# EAGLE design watchwinder (EAGLE 8.2.2)
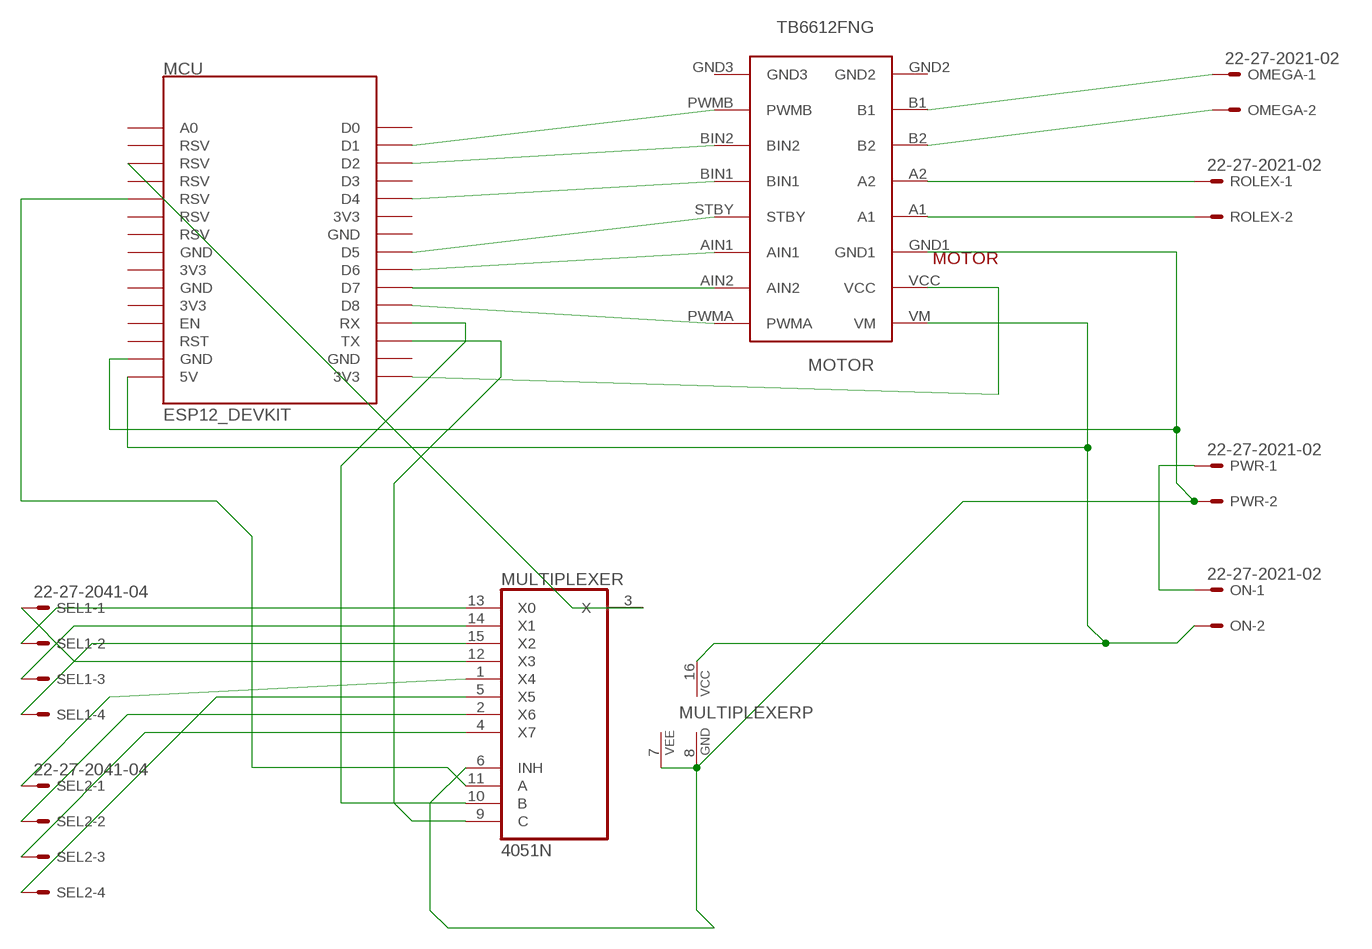
[diagram p0: schematic, sheet 1]

## Parts
MCU  ESP12_DEVKIT  [ESP12_DEVKIT]
MOTOR  TB6612FNG  [TB6612FNG]
MULTIPLEXER  4051N  [DIL16]
OMEGA  22-27-2021-02  [6410-02]
ON  22-27-2021-02  [6410-02]
PWR  22-27-2021-02  [6410-02]
ROLEX  22-27-2021-02  [6410-02]
SEL1  22-27-2041-04  [6410-04]
SEL2  22-27-2041-04  [6410-04]

## Nets
GND: MCU.GND@1(GND) MOTOR.GND1 MULTIPLEXER.6(INH) MULTIPLEXER.7(VEE) MULTIPLEXER.8(GND) PWR.2
N$1: MCU.D1 MOTOR.PWMB
N$2: MCU.D2 MOTOR.BIN2
N$3: MCU.D4 MOTOR.BIN1
N$4: MCU.D5 MOTOR.STBY
N$5: MCU.D6 MOTOR.AIN1
N$6: MCU.D7 MOTOR.AIN2
N$7: MCU.D8 MOTOR.PWMA
N$8: MOTOR.A2 ROLEX.1
N$9: MOTOR.A1 ROLEX.2
N$10: MOTOR.B1 OMEGA.1
N$11: MOTOR.B2 OMEGA.2
N$12: MCU.3V3@2(3V3) MOTOR.VCC
N$13: ON.1 PWR.1
N$14: MCU.5V MOTOR.VM MULTIPLEXER.16(VCC) ON.2
N$16: MULTIPLEXER.12(X3) SEL1.1
N$17: MULTIPLEXER.14(X1) SEL1.3
N$18: MULTIPLEXER.15(X2) SEL1.4
N$19: MULTIPLEXER.13(X0) SEL1.2
N$20: MULTIPLEXER.1(X4) SEL2.1
N$21: MULTIPLEXER.2(X6) SEL2.2
N$22: MULTIPLEXER.4(X7) SEL2.3
N$23: MULTIPLEXER.5(X5) SEL2.4
N$24: MCU.RX MULTIPLEXER.10(B)
N$25: MCU.RSV@3(RSV) MULTIPLEXER.11(A)
N$26: MCU.TX MULTIPLEXER.9(C)
N$27: MCU.RSV@1(RSV) MULTIPLEXER.3(X)
Unconnected: MCU.3V3@0(3V3) MCU.3V3@1(3V3) MCU.3V3@3(3V3) MCU.A0 MCU.D0 MCU.D3 MCU.EN MCU.GND@0(GND) MCU.GND@2(GND) MCU.GND@3(GND) MCU.GND@4(GND) MCU.RST MCU.RSV@0(RSV) MCU.RSV@2(RSV) MCU.RSV@4(RSV) MCU.RSV@5(RSV) MOTOR.GND2 MOTOR.GND3

## Library data of the parts
MCU = ESP12_DEVKIT:ESP12_DEVKIT: ESP12 DEVKIT BOARD
MOTOR = TB6612FNG:TB6612FNG
MULTIPLEXER = 40xx:4051: 8-channel ANALOG MULTIPLEXER
OMEGA ON PWR ROLEX = con-molex:22-?-02: CONNECTOR wire to board 2.54 mm (.1 inch) pitch header; OC_FARNELL: unknown; OC_NEWARK: unknown
SEL1 SEL2 = con-molex:22-?-04: CONNECTOR wire to board 2.54 mm (.1 inch) pitch header; OC_FARNELL: unknown; OC_NEWARK: unknown

## Net classes
0 default: width 0.508 mm, clearance 0.127 mm

## Board
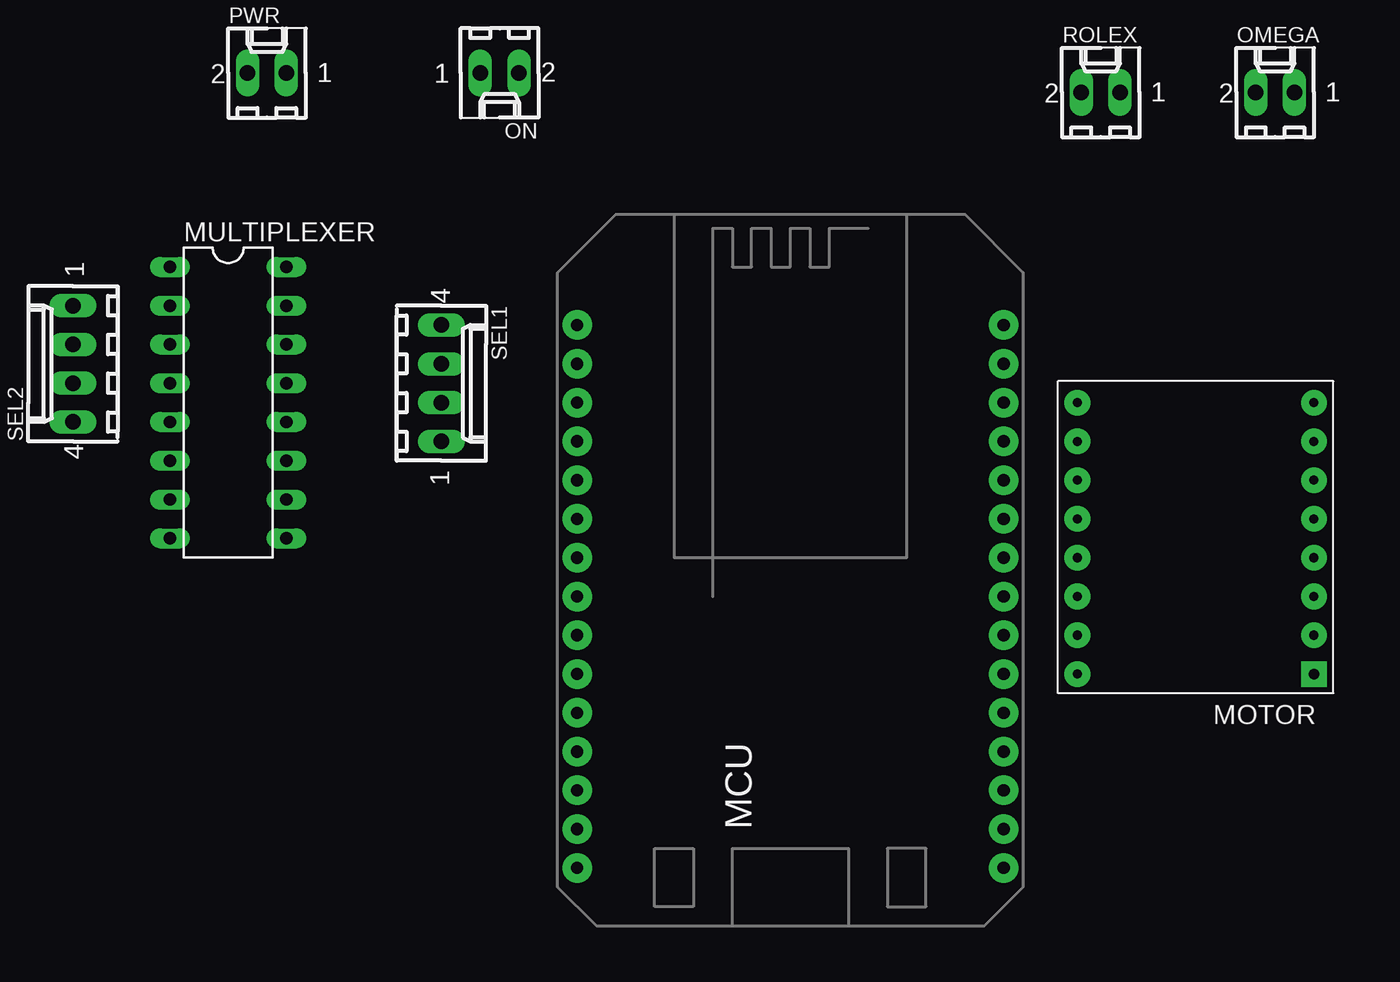
[diagram p1: board, top side]
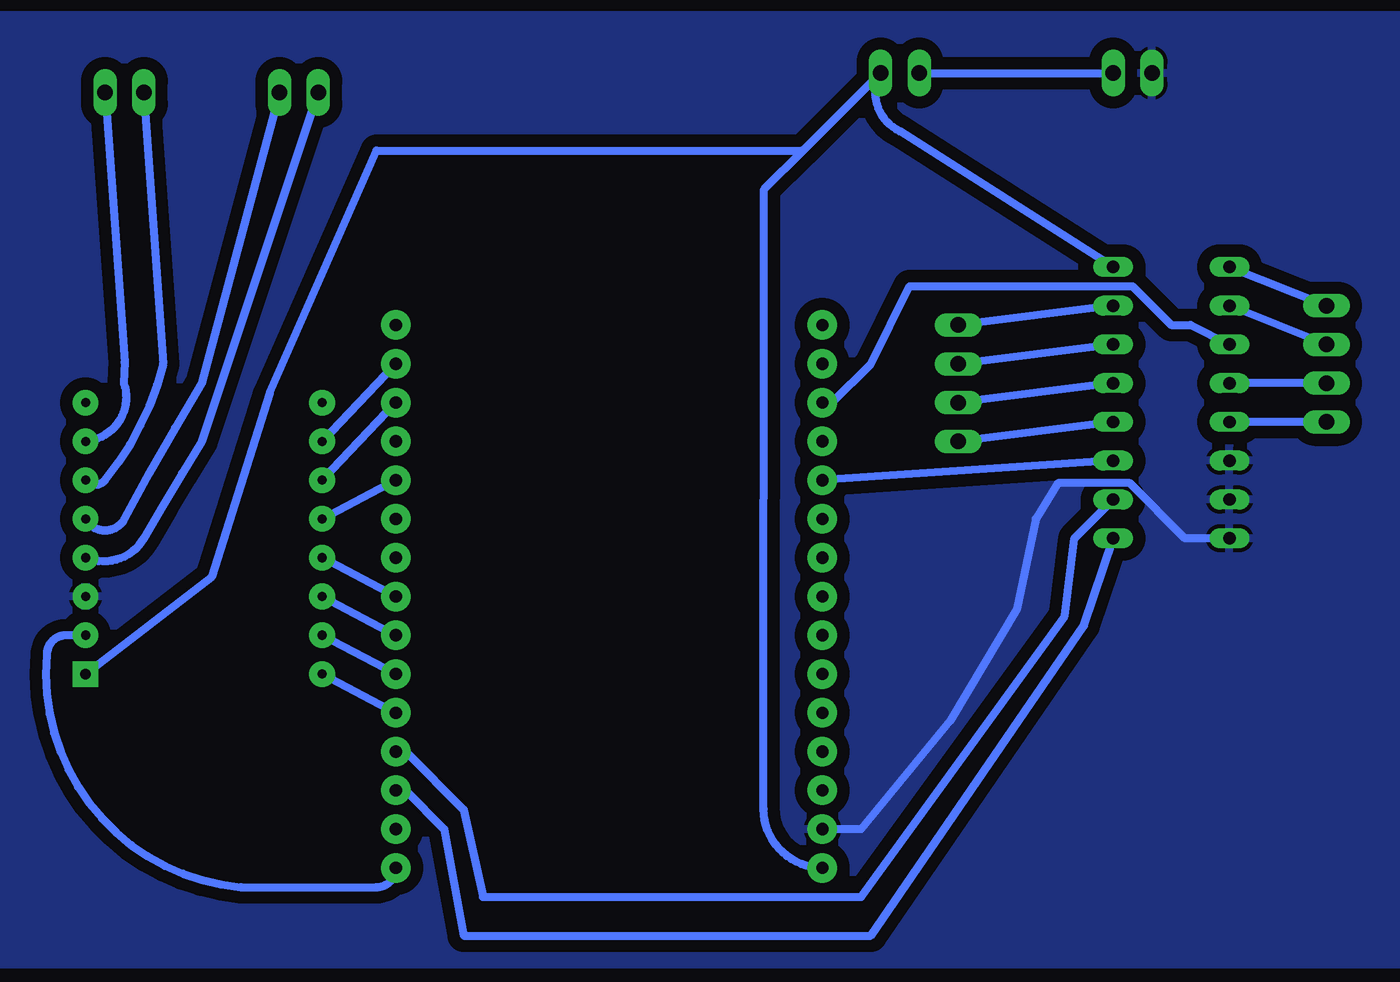
[diagram p2: board, bottom side, seen from below]

No outline drawn. Coordinates in mm, seen from the top.
Copper layers (1*16): Top 0.035mm / dielectric 1.5mm / Bottom 0.035mm
Design rules "default *": minimum track width 20mil, minimum drill 0.35mm, track to track 20mil, track to pad 6mil, pad to pad 6mil, via to via 20mil, smd to smd 6mil, copper to edge 40mil, drill to drill 6mil, minimum pad ring 10mil, minimum via ring 8mil, stop-mask expansion 4mil, vias tented up to drill 0mil, thermal gap 10mil

### Footprints (pad centres in the part's own frame; a part is rotated, then mirrored left to right if it is on the bottom)
ESP12_DEVKIT = drill 0.8 pad 1.93: 3V3@0 -13.97,-7.62; 3V3@1 13.97,5.08; 3V3@2 13.97,-17.78; 3V3@3 -13.97,-2.54; 5V -13.97,-17.78; A0 -13.97,17.78; D0 13.97,17.78; D1 13.97,15.24; D2 13.97,12.7; D3 13.97,10.16; D4 13.97,7.62; D5 13.97,0; D6 13.97,-2.54; D7 13.97,-5.08; D8 13.97,-7.62; EN -13.97,-10.16; GND@0 -13.97,-5.08; GND@1 -13.97,-15.24; GND@2 13.97,2.54; GND@3 13.97,-15.24; GND@4 -13.97,0; RST -13.97,-12.7; RSV@0 -13.97,15.24; RSV@1 -13.97,12.7; RSV@2 -13.97,10.16; RSV@3 -13.97,7.62; RSV@4 -13.97,5.08; RSV@5 -13.97,2.54; RX 13.97,-10.16; TX 13.97,-12.7
TB6612FNG = drill 0.6 pad 1.676: A1 -7.62,-1.27; A2 -7.62,-3.81; AIN1 7.874,1.27; AIN2 7.874,3.81; B1 -7.62,-8.89; B2 -7.62,-6.35; BIN1 7.874,-3.81; BIN2 7.874,-6.35; GND1 -7.62,1.27; GND2 -7.62,-11.43; GND3 7.874,-11.43; PWMA 7.874,6.35; PWMB 7.874,-8.89; STBY 7.874,-1.27; VCC -7.62,3.81 | drill 0.7 pad 1.676 square: VM -7.62,6.35
DIL16 = drill 0.813 long: 1 -8.89,-3.81; 2 -6.35,-3.81; 3 -3.81,-3.81; 4 -1.27,-3.81; 5 1.27,-3.81; 6 3.81,-3.81; 7 6.35,-3.81; 8 8.89,-3.81; 9 8.89,3.81; 10 6.35,3.81; 11 3.81,3.81; 12 1.27,3.81; 13 -1.27,3.81; 14 -3.81,3.81; 15 -6.35,3.81; 16 -8.89,3.81
6410-02 = drill 1.016 long: 1 1.27,0; 2 -1.27,0
6410-04 = drill 1.016 long: 1 3.81,0; 2 1.27,0; 3 -1.27,0; 4 -3.81,0

### Placement (x,y rotation side)
MCU  55.88,26.67 0 top
MOTOR  82.55,27.94 180 top
MULTIPLEXER  19.05,39.37 270 top
OMEGA  87.63,59.69 0 top
ON  36.83,60.96 180 top
PWR  21.59,60.96 0 top
ROLEX  76.2,59.69 0 top
SEL1  33.02,40.64 270 top
SEL2  8.89,41.91 90 top

### Tracks (layer width: path | path; a pad name or v marks a point on that pad's centre or on a via)
GND
  Bottom 0.508: 42.55,11.43 MCU.GND@1 39.37,11.43 33.52,18.55 29.15,25.85 27.94,31.75 26.47,34.09 21.76,34.09 18.15,30.48 MULTIPLEXER.8
  pour Bottom (isolate 0.813): 3.81,64.77 3.81,2.54 97.79,2.54 96.52,64.77
N$1
  Bottom 0.508: MOTOR.PWMB MCU.D1
N$2
  Bottom 0.508: MCU.D2 MOTOR.BIN2
N$3
  Bottom 0.508: MOTOR.BIN1 MCU.D4
N$4
  Bottom 0.508: MCU.D5 MOTOR.STBY
N$5
  Bottom 0.508: MOTOR.AIN1 MCU.D6
N$6
  Bottom 0.508: MCU.D7 MOTOR.AIN2
N$7
  Bottom 0.508: MOTOR.PWMA MCU.D8
N$8
  Bottom 0.508: ROLEX.1 82.55,40.64 arc-4 87.63,31.75 arc124 MOTOR.A2
N$9
  Bottom 0.508: ROLEX.2 82.55,36.83 arc-2 86.36,30.48 arc83 MOTOR.A1
N$10
  Bottom 0.508: OMEGA.1 87.61,42.02 87.66,40.65 arc103 MOTOR.B1
N$11
  Bottom 0.508: OMEGA.2 85.09,41.91 arc25 88.9,34.29 arc102 MOTOR.B2
N$12
  Bottom 0.508: MOTOR.VCC 91.44,24.13 arc-90 92.71,22.86 arc-90 80.01,7.62 71.12,7.62 arc-90 MCU.3V3@2
N$13
  Bottom 0.508: ON.1 PWR.1
N$14
  Bottom 0.508: MOTOR.VM 81.92,27.94 78.11,40.01 71.12,55.88 43.22,55.88 arc90 43.2,55.86 | MCU.5V arc90 45.76,12.74 45.72,53.34 43.2,55.86 | 43.2,55.86 ON.2 arc-93 36.83,57.15 MULTIPLEXER.16
N$16
  Bottom 0.508: MULTIPLEXER.12 SEL1.1
N$17
  Bottom 0.508: MULTIPLEXER.14 SEL1.3
N$18
  Bottom 0.508: MULTIPLEXER.15 SEL1.4
N$19
  Bottom 0.508: MULTIPLEXER.13 SEL1.2
N$20
  Bottom 0.508: SEL2.1 MULTIPLEXER.1
N$21
  Bottom 0.508: SEL2.2 MULTIPLEXER.2
N$22
  Bottom 0.508: SEL2.3 MULTIPLEXER.4
N$23
  Bottom 0.508: SEL2.4 MULTIPLEXER.5
N$24
  Bottom 0.508: MCU.RX 69.22,16.51 65.41,12.7 64.14,6.99 39.37,6.99 26.04,25.4 25.4,30.48 MULTIPLEXER.10
N$25
  Bottom 0.508: MULTIPLEXER.11 MCU.RSV@3
N$26
  Bottom 0.508: MCU.TX 69.22,13.97 66.67,11.43 65.41,4.45 38.73,4.45 24.77,24.77 MULTIPLEXER.9
N$27
  Bottom 0.508: MULTIPLEXER.3 17.78,44.45 19.05,44.45 21.59,46.99 36.2,46.99 38.73,41.91 41.27,39.37 MCU.RSV@1